# Altium schematic sheet Schematic new submission.SchDoc
size A4; SheetNumber: 1; SheetTotal: 1
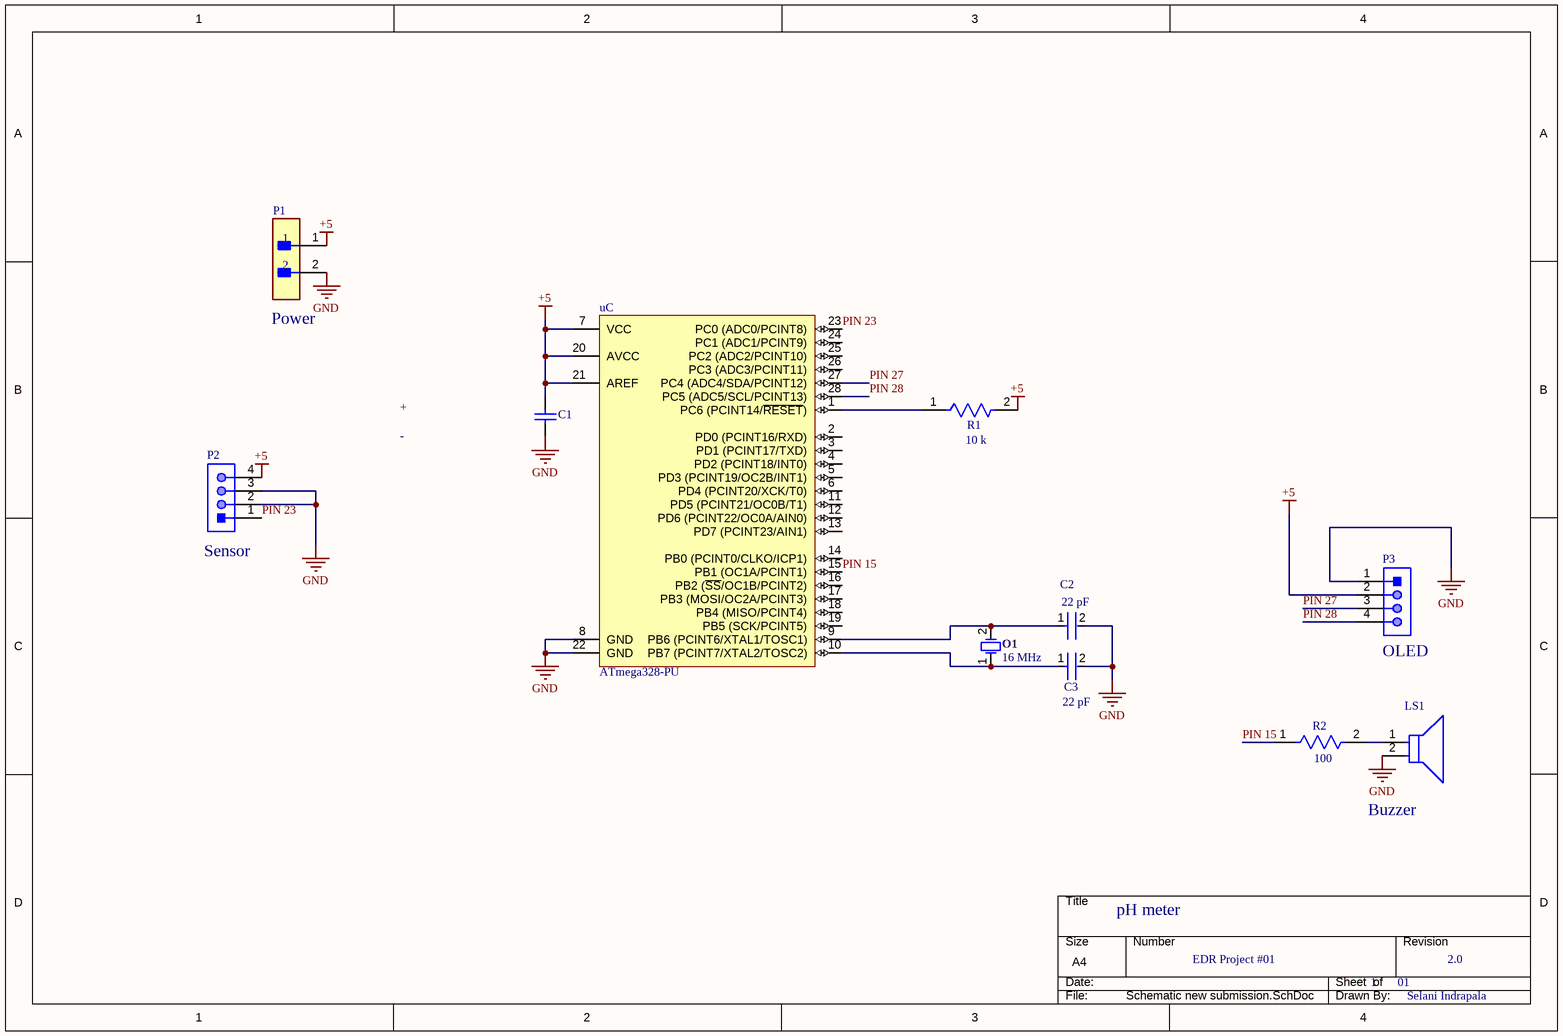
[diagram p0: Schematic new submission.SchDoc]

## Parts
C1  MD015E104MAB  [AVX-MD01]  (value not drawn)
C2  RCE5C1H220J0M1H03A  [FP-RCE0K1-MFG]  (value not drawn)
C3  RCE5C1H220J0M1H03A  [FP-RCE0K1-MFG]  (value not drawn)
LS1  PS1720P02  [FP-PS1720P02-MFG]  (value not drawn)
O1  FOXSLF/160-20  [FOX-FOXSLF160-20]  (value not drawn)
P1  M20-9990246  [FP-M20-9990246-MFG]  (value not drawn)
P2  Sensor  [61900411121]
P3  OLED  [61900411121]
R1  MBB02070C1002FCT00  [FP-MBB0207-MFG]  (value not drawn)
R2  RG1005P-101-B-T5  [FP-RG1005-IPC_B]  (value not drawn)
uC  ATmega328-PU  [28P3]

## Nets
+5: C1.2 P1.1 P2.4 P3.2 R1.2 uC.7(VCC) uC.20(AVCC) uC.21(AREF)
GND: C1.1 C2.2 C3.2 LS1.2 P1.2 P2.2 P2.3 P3.1 uC.8(GND) uC.22(GND)
PIN 15: R2.1 uC.15(PB1_(OC1A/PCINT1))
PIN 23: P2.1 uC.23(PC0_(ADC0/PCINT8))
PIN 27: P3.3 uC.27(PC4_(ADC4/SDA/PCINT12))
PIN 28: P3.4 uC.28(PC5_(ADC5/SCL/PCINT13))
NetC2_1: C2.1 O1.2 uC.9(PB6_(PCINT6/XTAL1/TOSC1))
NetC3_1: C3.1 O1.1 uC.10(PB7_(PCINT7/XTAL2/TOSC2))
NetLS1_1: LS1.1 R2.2
NetR1_1: R1.1 uC.1(PC6_(PCINT14/~{RESET}))

Not connected (* = marked no-connect by the designer): uC 2(PD0_(PCINT16/RXD)) 3(PD1_(PCINT17/TXD)) 4(PD2_(PCINT18/INT0)) 5(PD3_(PCINT19/OC2B/INT1)) 6(PD4_(PCINT20/XCK/T0)) 11(PD5_(PCINT21/OC0B/T1)) 12(PD6_(PCINT22/OC0A/AIN0)) 13(PD7_(PCINT23/AIN1)) 14(PB0_(PCINT0/CLKO/ICP1)) 16(PB2_(~{SS}/OC1B/PCINT2)) 17(PB3_(MOSI/OC2A/PCINT3)) 18(PB4_(MISO/PCINT4)) 19(PB5_(SCK/PCINT5)) 24(PC1_(ADC1/PCINT9)) 25(PC2_(ADC2/PCINT10)) 26(PC3_(ADC3/PCINT11))

## Notes on the sheet
- (near P1) Power
- +
- -
- (near R1) 10 k
- (near C2) 22 pF
- (near O1) 16 MHz
- (near C3) 22 pF
- (near R2) 100
- Buzzer
- pH meter
- EDR Project #01
- 1
- 01
- 2.0
- Selani Indrapala
- DWG. NO.
- REV.
- SHT.
- THIS DOCUMENT AND THE DATA DISCLOSED HEREIN OR HEREWITH IS THE PROPERTY OF ALTIUM LIMITED AND MAY BE FREELY DISTRIBUTED IN WHOLE. NO RIGHTS ARE RESERVED OR EXPRESS OR IMPLIED WARANTEE GIVEN.
- REVISION
- DESCRIPTION
- DATE
- APPROVED
- ENG:
- APPROVALS
- PROJECT
- DSN:
- CHK:
- REFERENCE DOCUMENTS
- PROJECT REVISION:
- TITLE
- DOCUMENT REVISION:
- DESIGN ITEM:
- BOM:
- FAB DWG:
- PCB DWG:
- ASSY DWG:
- SCALE:
- SIZE
- B
- CAGE CODE
- FILE NAME
- DWG NO.
- SHEET
- OF
- REV

## Library data of the parts
C1 = CMP-2000-06690-1: Ceramic Capacitor, 0.1 uF, +/- 20%, 50 V, -55 to 125 degC, 2-Pin THD (MD01), Bulk; Manufacturer: AVX; Dielectric: Z5U; Rated Voltage: 50V; Capacitance: 100nF; Mounting Technology: ThroughHole; Case Size/Dimension: 6.6x3.43x2.54mm; Package Reference: AVX-MD01; Datasheet URL: http://datasheets.avx.com/dipguard.pdf; Package Description: 2-Pin Through Hole Device, Body 6.6 x 2.54 mm; Datasheet Version: 08/2015; Tolerance (%): ±20%; Manufacturer URL: http://www.avx.com/
C2 C3 = CMP-06035-004895-1: Cap Ceramic 22pF 50V C0G ±5% Radial 5mm +125°C Automotive Bulk; Lead/Base Style: Formed Leads; Lead Diameter: 0.5mm; Max Operating Temperature: 125°C; Termination: Radial; Package Quantity: 2000; Capacitance: 22pF; Dielectric: C0G; Height - Seated (Max): 0.138inch; Width: 0.098inch; Lead Pitch: 0.197inch; Tolerance: 5%; Resistor Type: Ceramic; Case/Package: Radial; Mount: Through Hole; Voltage Rating: 50V; Ratings: AEC-Q200; Min Operating Temperature: -55°C; Packaging: Tape and Reel; Voltage Rating (DC): 50V; Height: 3.5mm; Length: 0.142inch
LS1 = CMP-08413-000001-1: AUDIO PIEZO TRANSDUCER 30V TH; Manufacturer: TDK Corporation; Description: Audio Buzzer Piezo 3Vo-p Pin Through Hole; Frequency: 2kHz; Standoff Height: 0.5mm; RoHS: TRUE; ComponentLink2URL: https://product.tdk.com/info/en/catalog/datasheets/piezoelectronic_buzzer_ps_en.pdf; ComponentLink2Description: Datasheet; Lead Free: Yes; Temperature Range High: +70°C; Category: Speak; Height: 8.3mm; Device Class L1: Electromechanical; Device Class L3: Buzzers; Package: 0; Mouser Description: Audio Indicators & Alerts Round 17mmx8mm 2 kHz Vin=3V; Manufacturer Part Number: PS1720P02; Digikey Description: AUDIO PIEZO TRANSDUCER 30V TH; Device Class L2: Audio Products; Temperature Range Low: -10°C; Automotive: No; Octopart: https://octopart.com/ps1720p02-tdk-154429; Temperature: -10°C to +70°C
O1 = CMP-1749-00003-1: Resistance Weld Thru-Hole Crystal, 16 MHz, -20 to 70 degC, 2-Pin THD, RoHS, Bulk; Voltage Rating: 250 V; Tolerance: 1%; Resistance: 221 kohm; Case\Package: Axial; Power Rating: 250 mW; RoHSCompliant: true; Package Quantity: 200; Packaging: Bulk; Min Operating Temperature: -55 degC; DatasheetVersion: Mar-15; ComponentLink1URL: http://www.foxonline.com/; Max Operating Temperature: 155 degC; PackageReference: FOXSLF160-20; Mount: Through Hole; PackageDescription: 2-Pin Through Hole Device, Body 11.35 x 4.65 mm; ComponentLink1Description: Manufacturer URL; ComponentLink2URL: http://www.foxonline.com/pdfs/hc49slf.pdf; ComponentLink2Description: Datasheet; Length: 0.248 inch
P1 = CMP-15831-000009-1: CONN HEADER VERT 2POS 2.54MM; Manufacturer: Harwin; Conn Gender: Male; Conn Orientation: Vertical; Number Of Contacts: 2; Current Rating: 3A; ComponentLink2URL: https://cdn.harwin.com/pdfs/M20-999.pdf; ComponentLink2Description: Datasheet; Package: M20-9990246; Temperature: -40°C to +105°C; Octopart: https://octopart.com/m20-9990246-harwin-2590635; Mouser Description: 2.54mm (0.1") Pitch SIL Vertical PC Tail Pin Header, 6.1mm mating pin height, tin, 2 contacts; Temperature Range High: +105°C; Device Class L1: Connectors; RoHS: TRUE; Automotive: No; Height: 8.99mm; Number Of Rows: 1; Contact Material: Tin,Nickel; Category: Conn; Pitch: 2.54mm; Lead Free: Yes; Digikey Description: CONN HEADER VERT 2POS 2.54MM; Manufacturer Part Number: M20-9990246; Temperature Range Low: -40°C; Device Class L3: unset; Device Class L2: Headers and Wire Housings
P2 P3 = CMP-1502-00586-1: Male Locking Header WR-WTB, THT, Vertical, pitch 2.54 mm, 1 x 4 position; Manufacturer: Wurth Elektronik; Working Voltage: 250VAC; Pitch: 2.54mm; Contact Resistance: 20mOhm; Position: 1x4; Publisher: WurthElektronik; Manufacturer URL: http://www.we-online.de; Datasheet URL: https://katalog.we-online.de/em/datasheet/6190xx11121.pdf; Operating Temperature: -40to105degC; Packaging: Bag; Gender: Male; Package Reference: 61900411121; Orientation: Vertical; Mounting Technology: THT; Part Number: 61900411121
R1 = CMP-02408-000035-1: RES 10K OHM 0.6W 1% AXIAL; Voltage Rating: 300V; Resistance: 10kR; Max Power Dissipation: 600mW; Temperature Coefficient: 50ppm/°C; Radiation Hardening: No; Case/Package: Conformal; Termination: Axial; Military Standard: Not; Length: 6.5mm; Voltage Rating (DC): 300V; RoHS Compliant: Yes; Number of Terminations: 2; Packaging: Tape and Reel; Features: Automotive AEC-Q200; Tolerance: 1%; Min Operating Temperature: -55°C; Power Rating: 600mW; Lead Free: Lead Free; Resistor Type: Metal Film; Construction: Cylindrical; Series: MBB 0207 - Professional; Max Operating Temperature: 155°C; Diameter: 2.5mm; Resistance Tolerance: 1%; Contact Plating: Tin; Technology: THIN FILM
R2 = CMP-2002-01209-2: Automotive Metal Thin Film Chip Resistor, 0402, 100Ω, 0.1%, 25ppm/°C, 0.0625W, 75V; Resistance: 100R; Voltage Rating (DC): 25V; Power Rating: 63mW; Case/Package: 0402; Width: 0.5mm; RoHS Compliant: Yes; Case Code (Imperial): 0402; Min Operating Temperature: -55°C; Size Code: 0402; Max Operating Temperature: 155°C; Length: 1mm; Features: Automotive AEC-Q200; Height: 0.35mm; Case Code (Metric): 1005; Series: RG; Voltage Rating: 75V; Packaging: Tape and Reel; Resistor Type: Thin Film; Lead Free: Lead Free; Number of Terminations: 2; Weight: 2.3E-05oz; Tolerance: 0.1%; Max Power Dissipation: 63mW; Temperature Coefficient: 25ppm/°C; Resistance Tolerance: 0.1%; Number of Pins: 2; Termination: SMD/SMT
uC = CMP-0095-00015-2: 8-bit AVR Microcontroller, 32KB Flash, 1KB EEPROM, 2KB SRAM, 28-pin PDIP, Industrial Grade (-40°C to 85°C); ComponentLink3Description: ATmega48A/48PA/88A/88PA/168A/168PA/328/328P Summary; RevisionNote: DatasheetVersion updated. URLs added.; DatasheetVersion: revD, May-2011; ComponentLink1URL: http://www.atmel.com/; PackageVersion: revB, Sep-2001; PackageDescription: 28-lead (0.300"/7.62mm Wide) Plastic Dual Inline Package (PDIP); PackageReference: 28P3; ComponentLink1Description: Manufacturer URL; ComponentLink2Description: ATmega48A/48PA/88A/88PA/168A/168PA/328/328P Datasheet; ComponentLink3URL: http://www.atmel.com/dyn/resources/prod_documents/8271S.pdf; ComponentLink2URL: http://www.atmel.com/dyn/resources/prod_documents/8271.pdf